# Altium schematic sheet Sheet.SchDoc
size A
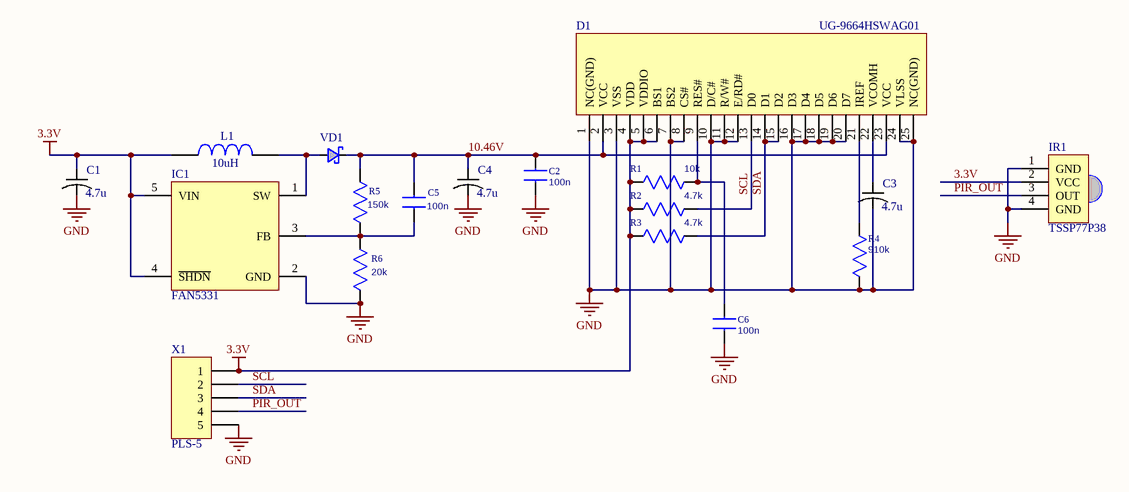
[diagram p0: Sheet.SchDoc]

## Parts
C1  4.7u  [TANTALUM_CAP_SIZE_A]
C2  100n  [C_0603]
C3  4.7u  [TANTALUM_CAP_SIZE_A]
C4  4.7u  [TANTALUM_CAP_SIZE_A]
C5  100n  [C_0603]
C6  100n  [C_0603]
D1  UG-9664HSWAG01  [UG-9664HSWAG01]
IC1  FAN5331  [SOT23-5]
IR1  TSSP77P38  [TSSP77P38]
L1  10uH  [L-7.5x7.5]
R1  10k  [R_0603]
R2  4.7k  [R_0603]
R3  4.7k  [R_0603]
R4  910k  [R_0603]
R5  150k  [R_0603]
R6  20k  [R_0603]
VD1  Schottky Diode  [DO-214AA]  (value not drawn)
X1  PLS-5  [PLS-5-3D]

## Nets
3.3V: C1.1 D1.4(VDD) D1.5(VDDIO) D1.6(BS1) IC1.4(~{SHDN}) IC1.5(VIN) IR1.2(VCC) L1.1 R1.1 R2.1 R3.1 X1.1
GND: C1.2 C2.1 C3.2 C4.2 C6.2 D1.1(NC(GND)) D1.3(VSS) D1.7(BS2) D1.8(CS#) D1.10(D/C#) D1.11(R/W#) D1.12(E/RD#) D1.16(D3) D1.17(D4) D1.18(D5) D1.19(D6) D1.20(D7) D1.24(VLSS) D1.25(NC(GND)) IC1.2(GND) IR1.1(GND) IR1.4(GND) R4.2 R6.1 X1.5
10.46V: C2.2 C4.1 C5.2 D1.2(VCC) D1.23(VCC) R5.2 VD1.C
PIR_OUT: IR1.3(OUT) X1.4
SCL: D1.13(D0) R2.2 X1.2
SDA: D1.14(D1) D1.15(D2) R3.2 X1.3
NetC3_1: C3.1 D1.22(VCOMH)
NetC5_1: C5.1 IC1.3(FB) R5.1 R6.2
NetC6_1: C6.1 D1.9(RES#) R1.2
NetD1_21: D1.21(IREF) R4.1
NetIC1_1: IC1.1(SW) L1.2 VD1.A

## Library data of the parts
C1 C3 C4 = Tantalum Capacitor
C2 C5 C6 = C0603: Capacitor; Value: 100n
D1 = UG-9664HSWAG01: Display
IC1 = FAN5331: High Efficiency Serial LED Driver and OLED Supp;y with 20V Integrated Switch
IR1 = TSSP77P38: IR Detector for Mid Range Proximity Sensor
L1 = L: Inductor; Value: 10uH
R1-R6 = R0603: Resistor
  R1: Value: 10k
  R2 R3: Value: 4.7k
  R4: Value: 910k
  R5: Value: 150k
  R6: Value: 20k
VD1 = Schottky: SCHOTTKY BARRIER RECTIFIER
X1 = PLS-5: Header, 5-Pin; LatestRevisionDate: 17-Jul-2002; LatestRevisionNote: Re-released for DXP Platform.; Publisher: Altium Limited